# Altium schematic sheet STLINK.SchDoc: Title
size A3; Date: *******; ApprovedBy: *******; CheckedBy: None; Author: *******; CompanyName: *******; DrawnBy: Jacob Chisholm; Engineer: *******; Organization: *******; Address1: *******; Address2: *******; Address3: *******; Address4: *******; DocumentNumber: 1; Revision: *******; SheetNumber: 1; SheetTotal: 2; Address_Website: https://jchisholm204.github.io; E-Mail: JacobChisholm1010@gmail.com; CurrentTime: *******; CurrentDate: *******; Time: *******; DocumentFullPathAndName: *******; DocumentName: *******; ModifiedDate: *******; ImagePath: *******; ProjectName: *******; Application_BuildNumber: *******
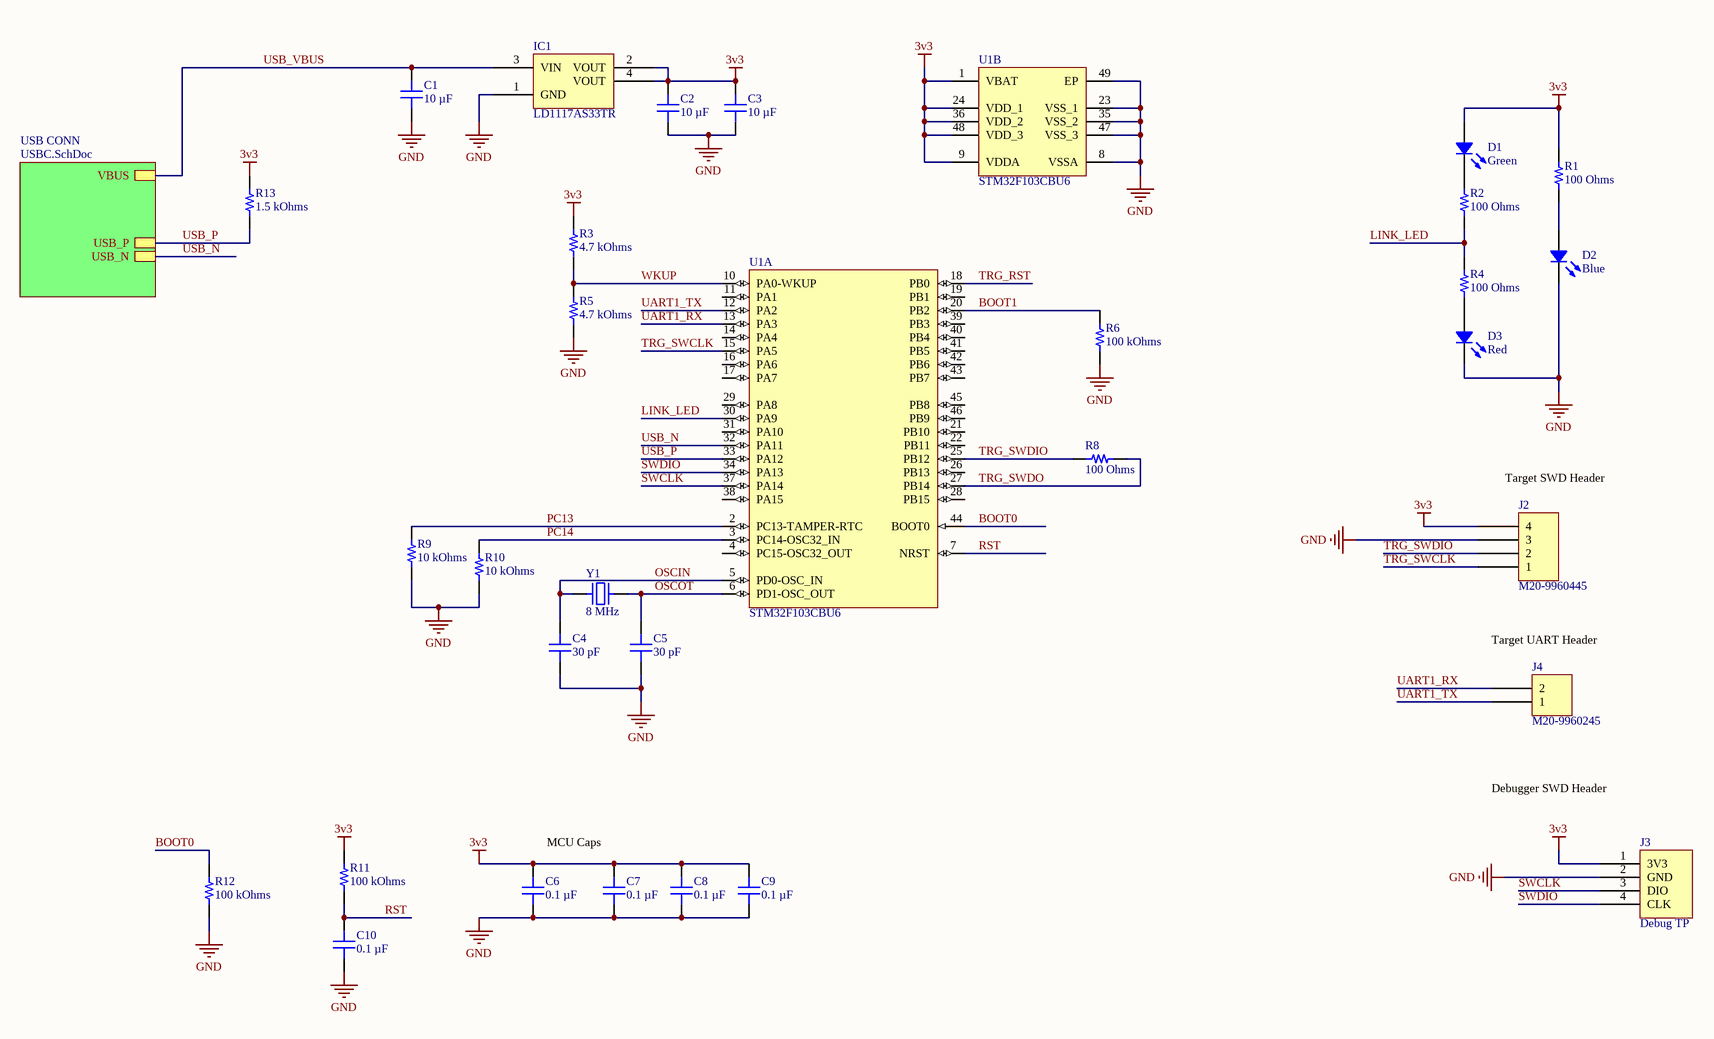
[diagram p0: STLINK.SchDoc]

## Parts
C1  10 µF  [CAP 0603_1608]
C2  10 µF  [CAP 0603_1608]
C3  10 µF  [CAP 0603_1608]
C4  30 pF  [CAP 0603_1608]
C5  30 pF  [CAP 0603_1608]
C6  0.1 µF  [CAP 0603_1608]
C7  0.1 µF  [CAP 0603_1608]
C8  0.1 µF  [CAP 0603_1608]
C9  0.1 µF  [CAP 0603_1608]
C10  0.1 µF  [CAP 0603_1608]
D1  Green  [LED 0603_1608 GREEN]
D2  Blue  [LED 0603_1608 BLUE]
D3  Red  [LED 0603_1608 RED]
IC1  LD1117AS33TR  [ST SOT-223]
J2  M20-9960445  [HARWIN M20-9960445]
J3  Debug TP  [CAPC2121X00N]
J4  M20-9960245  [HARWIN M20-9960245]
R1  100 Ohms  [RES 0603_1608]
R2  100 Ohms  [RES 0603_1608]
R3  4.7 kOhms  [RES 0603_1608]
R4  100 Ohms  [RES 0603_1608]
R5  4.7 kOhms  [RES 0603_1608]
R6  100 kOhms  [RES 0603_1608]
R8  100 Ohms  [RES 0603_1608]
R9  10 kOhms  [RES 0603_1608]
R10  10 kOhms  [RES 0603_1608]
R11  100 kOhms  [RES 0603_1608]
R12  100 kOhms  [RES 0603_1608]
R13  1.5 kOhms  [RES 0603_1608]
U1  STM32F103CBU6  [STM-UFQFPN48_N]  (parts A,B of 2)
Y1  8 MHz  [NDK NX3225GD]

## Sub-sheets
USB CONN = USBC.SchDoc: VBUS, USB_P, USB_N

## Nets
3v3: C2.2 C3.2 C6.2 C7.2 C8.2 C9.2 D1.1 IC1.2(VOUT) IC1.4(VOUT) J2.4 J3.1(3V3) R1.2 R3.2 R11.2 R13.2 U1.1(VBAT) U1.9(VDDA) U1.24(VDD_1) U1.36(VDD_2) U1.48(VDD_3)
GND: C1.1 C2.1 C3.1 C4.1 C5.1 C6.1 C7.1 C8.1 C9.1 C10.1 D2.2 D3.2 IC1.1(GND) J2.3 J3.2(GND) R5.1 R6.1 R9.1 R10.1 R12.1 U1.8(VSSA) U1.23(VSS_1) U1.35(VSS_2) U1.47(VSS_3) U1.49(EP)
BOOT0: R12.2 U1.44(BOOT0)
BOOT1: R6.2 U1.20(PB2)
LINK_LED: R2.1 R4.2 U1.30(PA9)
OSCIN: C4.2 U1.5(PD0-OSC_IN) Y1.1
OSCOT: C5.2 U1.6(PD1-OSC_OUT) Y1.2
PC13: R9.2 U1.2(PC13-TAMPER-RTC)
PC14: R10.2 U1.3(PC14-OSC32_IN)
RST: C10.2 R11.1 U1.7(NRST)
SWCLK: J3.3(DIO) U1.37(PA14)
SWDIO: J3.4(CLK) U1.34(PA13)
TRG_RST: U1.18(PB0)
TRG_SWCLK: J2.1 U1.15(PA5)
TRG_SWDIO: J2.2 R8.1 U1.25(PB12)
TRG_SWDO: R8.2 U1.27(PB14)
UART1_RX: J4.2 U1.13(PA3)
UART1_TX: J4.1 U1.12(PA2)
USB_N: U1.32(PA11) ; sheet USB CONN/USB_N
USB_P: R13.1 U1.33(PA12) ; sheet USB CONN/USB_P
USB_VBUS: C1.2 IC1.3(VIN) ; sheet USB CONN/VBUS
WKUP: R3.1 R5.2 U1.10(PA0-WKUP)
NetD1_2: D1.2 R2.2
NetD2_1: D2.1 R1.1
NetD3_1: D3.1 R4.1

Not connected (* = marked no-connect by the designer): U1 4(PC15-OSC32_OUT) 11(PA1) 14(PA4) 16(PA6) 17(PA7) 19(PB1) 21(PB10) 22(PB11) 26(PB13) 28(PB15) 29(PA8) 31(PA10) 38(PA15) 39(PB3) 40(PB4) 41(PB5) 42(PB6) 43(PB7) 45(PB8) 46(PB9)

## Notes on the sheet
- (near J2) Target SWD Header
- (near J4) Target UART Header
- Debugger SWD Header
- MCU Caps
- Title:
- Drawn By:
- Page Contents:
- Checked By:
- Size:
- Date:
- File:
- License:
- Email:
- A3
- Number:
- Time:
- Revision:
- Sheet
- Website:
- of

## Library data of the parts
C1-C3 = GMC10X5R106M10NT: CAP0603 X5R 10UF 20% 10V; manufacturer: Cal-Chip Electronics, Inc.; Part Number: GMC10X5R106M10NT; Value: 10 µF; Applications: General Purpose; Capacitance: 10 µF; componentlink1description: Datasheet; componentlink1url: https://88ce57.p3cdn1.secureserver.net/wp-content/uploads/2023/01/gmc_series-2.pdf; componentlink2description: DigiKey Link; componentlink2url: https://www.digikey.com/en/products/detail/cal-chip-electronics-inc/GMC10X5R106M10NT/18151101; Device Package: 0603 (1608 Metric); lastupdated: 2/9/2024 8:08:49 PM; Lifecycle Status: Active; Minimum Order: 1; Mounting Type: Surface Mount, MLCC; Operating Temperature: -55°C ~ 85°C; Package / Case: 0603 (1608 Metric); packaging: TapeAndReel; partid: 55951; price: 0.01; series: GMC; Size / Dimension: 0.063" L x 0.031" W (1.60mm x 0.80mm); Supplier 1: DigiKey; Supplier Part Number 1: 4713-GMC10X5R106M10NTCT-ND; Temperature Coefficient: X5R; Thickness (Max): 0.039" (1.00mm); Tolerance: ±20%; Voltage - Rated: 10V
C4 C5 = 0603N300J500CT: CAP CER 30PF 50V C0G/NP0 0603; manufacturer: Walsin Technology Corporation; Temperature Coefficient: C0G, NP0; Tolerance: ±5%; Part Number: 0603N300J500CT; Value: 30 pF; Applications: General Purpose; Capacitance: 30 pF; componentlink1description: Datasheet; componentlink1url: http://www.passivecomponent.com/wp-content/uploads/2018/10/MLCC.pdf; componentlink2description: DigiKey Link; componentlink2url: https://www.digikey.com/en/products/detail/walsin-technology-corporation/0603N300J500CT/9355012; Device Package: 0603 (1608 Metric); lastupdated: 2/9/2024 8:10:20 PM; Lifecycle Status: Active; Minimum Order: 1; Mounting Type: Surface Mount, MLCC; Operating Temperature: -55°C ~ 125°C; Package / Case: 0603 (1608 Metric); packaging: TapeAndReel; partid: 9974; Part Status: Active; price: 0.01; series: -; Size / Dimension: 0.063" L x 0.031" W (1.60mm x 0.80mm); Supplier 1: DigiKey; Supplier Part Number 1: 1292-1515-1-ND; Thickness (Max): 0.034" (0.87mm); Voltage - Rated: 50V
C6-C10 = GMC10X7R104K25NT: CAP0603 X7R .1UF 10% 25V; manufacturer: Cal-Chip Electronics, Inc.; Part Number: GMC10X7R104K25NT; Value: 0.1 µF; Applications: General Purpose; Capacitance: 0.1 µF; componentlink1description: Datasheet; componentlink1url: https://88ce57.p3cdn1.secureserver.net/wp-content/uploads/2023/01/gmc_series-2.pdf; componentlink2description: DigiKey Link; componentlink2url: https://www.digikey.com/en/products/detail/cal-chip-electronics-inc/GMC10X7R104K25NT/19910724; Device Package: 0603 (1608 Metric); lastupdated: 2/9/2024 8:08:39 PM; Lifecycle Status: Active; Minimum Order: 1; Mounting Type: Surface Mount, MLCC; Operating Temperature: -55°C ~ 125°C; Package / Case: 0603 (1608 Metric); packaging: TapeAndReel; partid: 56631; price: 0.01; series: GMC; Size / Dimension: 0.063" L x 0.031" W (1.60mm x 0.80mm); Supplier 1: DigiKey; Supplier Part Number 1: 4713-GMC10X7R104K25NTCT-ND; Temperature Coefficient: X7R; Thickness (Max): 0.035" (0.90mm); Tolerance: ±10%; Voltage - Rated: 25V
D1 = 19-213/GVC-AMNB/3T: LED GREEN CLEAR 2SMD; Manufacturer: Everlight Electronics Co Ltd; Configuration: Standard; Current - Test: 20mA; Lens Color: Colorless; Lens Size: 1.20mm x 0.80mm; Lens Style: Rectangle with Flat Top; Viewing Angle: 120°; Voltage - Forward (Vf) (Typ): 2.05V; Wavelength - Peak: 568nm; Part Number: 19-213/GVC-AMNB/3T; Color: Green; ComponentLink1Description: Datasheet; ComponentLink1URL: //media.digikey.com/pdf/Data%20Sheets/Everlight%20PDFs/19-213-GVC-AMNB-3T.pdf; ComponentLink2Description: DigiKey Link; ComponentLink2URL: https://www.digikey.com/en/products/detail/everlight-electronics-co-ltd/19-213-GVC-AMNB-3T/8535270; Device Package: 0603 (1608 Metric); Height (Max): 0.70mm; LastUpdated: 6/3/2024 7:58:53 PM; Lens Transparency: Clear; Lifecycle Status: Active; Minimum Order: 1; Mounting Type: Surface Mount; Package / Case: 0603 (1608 Metric); Packaging: TapeAndReel; PartId: 611; Part Status: Active; Price: 0.06; Series: -; Size / Dimension: 1.60mm L x 0.80mm W; Supplier 1: DigiKey; Supplier Part Number 1: 1080-1576-1-ND; Supplier Device Package: 2-SMD; Value: Green
D2 = 19-217/B7C-ZL2N1B3X/3T: LED BLUE CLEAR 2SMD; Manufacturer: Everlight Electronics Co Ltd; Configuration: Standard; Current - Test: 2mA; Lens Color: Colorless; Lens Size: 1.00mm x 0.80mm; Lens Style: Rectangle with Flat Top; Viewing Angle: 120°; Voltage - Forward (Vf) (Typ): 2.7V; Wavelength - Dominant: 470nm; Wavelength - Peak: 468nm; Part Number: 19-217/B7C-ZL2N1B3X/3T; Color: Blue; ComponentLink1Description: Datasheet; ComponentLink1URL: //media.digikey.com/pdf/Data%20Sheets/Everlight%20PDFs/19-217-B7C-ZL2N1B3X-3T.pdf; ComponentLink2Description: DigiKey Link; ComponentLink2URL: https://www.digikey.com/en/products/detail/everlight-electronics-co-ltd/19-217-B7C-ZL2N1B3X-3T/8535278; Device Package: 0603 (1608 Metric); Height (Max): 0.50mm; LastUpdated: 6/3/2024 7:57:52 PM; Lens Transparency: Clear; Lifecycle Status: Active; Minimum Order: 1; Mounting Type: Surface Mount; Package / Case: 0603 (1608 Metric); Packaging: TapeAndReel; PartId: 797; Part Status: Active; Price: 0.08; Series: -; Size / Dimension: 1.60mm L x 0.80mm W; Supplier 1: DigiKey; Supplier Part Number 1: 1080-1584-1-ND; Supplier Device Package: 2-SMD; Value: Blue
D3 = 19-213SDRC/S259/TR8: LED RED CLEAR 2SMD; Manufacturer: Everlight Electronics Co Ltd; Configuration: Standard; Current - Test: 10mA; Lens Color: Colorless; Lens Size: 1.20mm x 0.80mm; Lens Style: Rectangle with Flat Top; Viewing Angle: 120°; Voltage - Forward (Vf) (Typ): 2V; Wavelength - Peak: 650nm; Part Number: 19-213SDRC/S259/TR8; Color: Red; ComponentLink1Description: Datasheet; ComponentLink1URL: //media.digikey.com/pdf/Data%20Sheets/Everlight%20PDFs/19-213SDRC-S259-TR8.pdf; ComponentLink2Description: DigiKey Link; ComponentLink2URL: http://digikey.com/product-detail/en/everlight-electronics-co-ltd/19-213SDRC-S259-TR8/1080-1580-1-ND/8535303; Device Package: 0603 (1608 Metric); Height (Max): 0.70mm; LastUpdated: 6/3/2024 7:59:48 PM; Lens Transparency: Clear; Lifecycle Status: Active; Minimum Order: 1; Mounting Type: Surface Mount; Package / Case: 0603 (1608 Metric); Packaging: TapeAndReel; PartId: 372; Part Status: Active; Price: 0.06; Series: -; Size / Dimension: 1.60mm L x 0.80mm W; Supplier 1: DigiKey; Supplier Part Number 1: 1080-1580-1-ND; Supplier Device Package: 2-SMD; Value: Red
IC1 = LD1117AS33TR: IC REG LINEAR 3.3V 1A SOT223; Manufacturer: STMicroelectronics; Current - Quiescent (Iq): 10 mA; Number of Regulators: 1; Output Configuration: Positive; Output Type: Fixed; Protection Features: Over Current, Over Temperature; PSRR: 75dB (120Hz); Voltage Dropout (Max): 1.3V @ 1A; Voltage - Input (Max): 15V; Part Number: LD1117AS33TR; ComponentLink1Description: Datasheet; ComponentLink1URL: http://www.st.com/content/ccc/resource/technical/document/datasheet/a5/c3/3f/c9/2b/15/40/49/CD00002116.pdf/files/CD00002116.pdf/jcr:content/translations/en.CD00002116.pdf; ComponentLink2Description: DigiKey Link; ComponentLink2URL: https://www.digikey.com/en/products/detail/stmicroelectronics/LD1117AS33TR/585752; Current - Output: 1A; LastUpdated: 6/3/2024 8:14:21 PM; Lifecycle Status: Active; Minimum Order: 1; Mounting Type: Surface Mount; Operating Temperature: 0°C ~ 125°C; Package / Case: TO-261-4, TO-261AA; Packaging: TapeAndReel; Part Status: Active; Price: 0.32; Series: -; Supplier 1: DigiKey; Supplier Part Number 1: 497-1228-1-ND; Supplier Device Package: SOT-223; Voltage - Output (Min/Fixed): 3.3V
J2 = M20-9960445: CONN HEADER R/A 4POS 2.54MM; Manufacturer: Harwin Inc.; Connector Type: Header, Cuttable; Contact Length - Mating: 0.240" (6.10mm); Contact Length - Post: 0.118" (3.00mm); Current Rating (Amps): 3A per Contact; Material Flammability Rating: UL94 V-0; Number of Positions: 4; Number of Positions Loaded: All; Pitch - Mating: 0.100" (2.54mm); Row Spacing - Mating: -40°C ~ 105°C; Shrouding: Unshrouded; Style: Board to Board or Cable; Part Number: M20-9960445; ComponentLink1Description: Datasheet; ComponentLink1URL: https://cdn.harwin.com/pdfs/Harwin_PC_Connectors_M20.pdf; ComponentLink2Description: DigiKey Link; ComponentLink2URL: https://www.digikey.com/en/products/detail/harwin-inc/M20-9960445/3921052; Contact Finish - Mating: Gold; Contact Material: Brass; Contact Shape: Square; Contact Type: Male Pin; Fastening Type: Push-Pull; Insulation Color: Black; Insulation Height: 0.100" (2.54mm); Insulation Material: Polyamide (PA6T), Nylon 6T; LastUpdated: 9/21/2022 7:23:20 PM; Lifecycle Status: Active; Minimum Order: 1; Mounting Type: Through Hole, Right Angle; Number of Rows: 1; Operating Temperature: -40°C ~ 105°C; Packaging: Bulk; PartId: 167; Part Status: Active; Price: 0.11; Series: M20; Supplier 1: DigiKey; Supplier Part Number 1: 952-3286-ND; Termination: Solder
J3 = CMP-00016-1: ST-Link Test Point
J4 = M20-9960245: CONN HEADER R/A 2POS 2.54MM; Manufacturer: Harwin Inc.; Connector Type: Header, Cuttable; Contact Length - Mating: 0.240" (6.10mm); Contact Length - Post: 0.118" (3.00mm); Current Rating (Amps): 3A per Contact; Material Flammability Rating: UL94 V-0; Number of Positions: 2; Number of Positions Loaded: All; Pitch - Mating: 0.100" (2.54mm); Row Spacing - Mating: -40°C ~ 105°C; Shrouding: Unshrouded; Style: Board to Board or Cable; Part Number: M20-9960245; ComponentLink1Description: Datasheet; ComponentLink1URL: https://cdn.harwin.com/pdfs/Harwin_PC_Connectors_M20.pdf; ComponentLink2Description: DigiKey Link; ComponentLink2URL: https://www.digikey.com/en/products/detail/harwin-inc/M20-9960245/3728208; Contact Finish - Mating: Gold; Contact Material: Brass; Contact Shape: Square; Contact Type: Male Pin; Fastening Type: Push-Pull; Insulation Color: Black; Insulation Height: 0.100" (2.54mm); Insulation Material: Polyamide (PA6T), Nylon 6T; LastUpdated: 9/21/2022 7:22:55 PM; Lifecycle Status: Active; Minimum Order: 1; Mounting Type: Through Hole, Right Angle; Number of Rows: 1; Operating Temperature: -40°C ~ 105°C; Packaging: Bulk; PartId: 165; Part Status: Active; Price: 0.07; Series: M20; Supplier 1: DigiKey; Supplier Part Number 1: 952-2244-ND; Termination: Solder
R1 R2 R4 R8 = RCA0603100RJNEA: RCA0603 100R 5% 200 ET1 E3; Manufacturer: Vishay Dale; Power (Watts): 0.1W, 1/10W; Temperature Coefficient: ±200ppm/°C; Part Number: RCA0603100RJNEA; Value: 100 Ohms; ComponentLink1Description: Datasheet; ComponentLink1URL: https://www.vishay.com/docs/20037/rcae3.pdf; ComponentLink2Description: DigiKey Link; ComponentLink2URL: https://www.digikey.com/en/products/detail/vishay-dale/RCA0603100RJNEA/19522959; Composition: Thick Film; Device Package: 0603 (1608 Metric); Features: Anti-Sulfur, Automotive AEC-Q200; Height - Seated (Max): 0.020" (0.50mm); LastUpdated: 2/9/2024 8:40:41 PM; Lifecycle Status: Active; Minimum Order: 1; Number of Terminations: 2; Operating Temperature: -55°C ~ 155°C; Package / Case: 0603 (1608 Metric); Packaging: TapeAndReel; PartId: 78145; Part Status: Active; Price: 0.01; Ratings: AEC-Q200; Resistance: 100 Ohms; Series: RCA; Size / Dimension: 0.061" L x 0.033" W (1.55mm x 0.85mm); Supplier 1: DigiKey; Supplier Part Number 1: 541-RCA0603100RJNEACT-ND; Supplier Device Package: 0603; Tolerance: ±5%
R3 R5 = ERA-3VRW4701V: RES 4.7K OHM 0.05% 1/8W 0603; Manufacturer: Panasonic Electronic Components; Power (Watts): 0.125W, 1/8W; Temperature Coefficient: ±10ppm/°C; Part Number: ERA-3VRW4701V; Value: 4.7 kOhms; ComponentLink1Description: Datasheet; ComponentLink1URL: https://api.pim.na.industrial.panasonic.com/file_stream/main/fileversion/9152; ComponentLink2Description: DigiKey Link; ComponentLink2URL: https://www.digikey.com/en/products/detail/panasonic-electronic-components/ERA-3VRW4701V/12086954; Composition: Thin Film; Device Package: 0603 (1608 Metric); Features: Anti-Sulfur, Automotive AEC-Q200; Height - Seated (Max): 0.022" (0.55mm); LastUpdated: 2/9/2024 8:41:01 PM; Lifecycle Status: Active; Minimum Order: 1; Number of Terminations: 2; Operating Temperature: -55°C ~ 155°C; Package / Case: 0603 (1608 Metric); Packaging: TapeAndReel; PartId: 71885; Part Status: Active; Price: 0.19; Ratings: AEC-Q200; Resistance: 4.7 kOhms; Series: ERA-3V; Size / Dimension: 0.063" L x 0.031" W (1.60mm x 0.80mm); Supplier 1: DigiKey; Supplier Part Number 1: 10-ERA-3VRW4701VCT-ND; Supplier Device Package: 0603; Tolerance: ±0.05%
R6 R11 R12 = MCT0603MG1003BP500: MCT 0603-05 0.1% AT P5 100K; Manufacturer: Vishay Beyschlag/Draloric/BC Components; Power (Watts): 0.21W; Temperature Coefficient: ±5ppm/°C; Part Number: MCT0603MG1003BP500; Value: 100 kOhms; ComponentLink1Description: Datasheet; ComponentLink1URL: https://www.vishay.com/docs/28952/mcs0402at-mcs0603at-mcu0805at-mca1206at.pdf; ComponentLink2Description: DigiKey Link; ComponentLink2URL: https://www.digikey.com/en/products/detail/vishay-beyschlag-draloric-bc-components/MCT0603MG1003BP500/19251865; Composition: Thin Film; Device Package: 0603 (1608 Metric); Features: Anti-Sulfur, Automotive AEC-Q200, Moisture Resistant; Height - Seated (Max): 0.022" (0.55mm); LastUpdated: 2/9/2024 8:40:40 PM; Lifecycle Status: Active; Minimum Order: 1; Number of Terminations: 2; Operating Temperature: -55°C ~ 175°C; Package / Case: 0603 (1608 Metric); Packaging: TapeAndReel; PartId: 78329; Part Status: Active; Price: 0.72; Ratings: AEC-Q200; Resistance: 100 kOhms; Series: MCT AT - Precision; Size / Dimension: 0.061" L x 0.033" W (1.55mm x 0.85mm); Supplier 1: DigiKey; Supplier Part Number 1: 749-MCT0603MG1003BP500CT-ND; Supplier Device Package: 0603; Tolerance: ±0.1%
R9 R10 = MCT0603MG1002BP500: MCT 0603-05 0.1% AT P5 10K; Manufacturer: Vishay Beyschlag/Draloric/BC Components; Power (Watts): 0.21W; Temperature Coefficient: ±5ppm/°C; Part Number: MCT0603MG1002BP500; Value: 10 kOhms; ComponentLink1Description: Datasheet; ComponentLink1URL: https://www.vishay.com/docs/28952/mcs0402at-mcs0603at-mcu0805at-mca1206at.pdf; ComponentLink2Description: DigiKey Link; ComponentLink2URL: https://www.digikey.com/en/products/detail/vishay-beyschlag-draloric-bc-components/MCT0603MG1002BP500/19251868; Composition: Thin Film; Device Package: 0603 (1608 Metric); Features: Anti-Sulfur, Automotive AEC-Q200, Moisture Resistant; Height - Seated (Max): 0.022" (0.55mm); LastUpdated: 2/9/2024 8:40:40 PM; Lifecycle Status: Active; Minimum Order: 1; Number of Terminations: 2; Operating Temperature: -55°C ~ 175°C; Package / Case: 0603 (1608 Metric); Packaging: TapeAndReel; PartId: 78314; Part Status: Active; Price: 0.72; Ratings: AEC-Q200; Resistance: 10 kOhms; Series: MCT AT - Precision; Size / Dimension: 0.061" L x 0.033" W (1.55mm x 0.85mm); Supplier 1: DigiKey; Supplier Part Number 1: 749-MCT0603MG1002BP500CT-ND; Supplier Device Package: 0603; Tolerance: ±0.1%
R13 = PTN0603Y1501BST1: PTN0603 10PPM 1.5K 0.1% S T1 E1; Manufacturer: Vishay Dale Thin Film; Power (Watts): 0.15W; Temperature Coefficient: ±10ppm/°C; Part Number: PTN0603Y1501BST1; Value: 1.5 kOhms; ComponentLink1Description: Datasheet; ComponentLink1URL: https://www.vishay.com/docs/60026/ptn.pdf; ComponentLink2Description: DigiKey Link; ComponentLink2URL: https://www.digikey.com/en/products/detail/vishay-dale-thin-film/PTN0603Y1501BST1/12820673; Composition: Thin Film; Device Package: 0603 (1608 Metric); Features: Anti-Sulfur, Moisture Resistant, Non-Inductive; Height - Seated (Max): 0.020" (0.51mm); LastUpdated: 2/9/2024 8:41:32 PM; Lifecycle Status: Active; Minimum Order: 1; Number of Terminations: 2; Operating Temperature: -55°C ~ 155°C; Package / Case: 0603 (1608 Metric); Packaging: TapeAndReel; PartId: 63062; Part Status: Active; Price: 0.27; Resistance: 1.5 kOhms; Series: PTN; Size / Dimension: 0.064" L x 0.032" W (1.63mm x 0.81mm); Supplier 1: DigiKey; Supplier Part Number 1: 764-PTN0603Y1501BST1CT-ND; Supplier Device Package: 0603; Tolerance: ±0.1%
U1 = CMP-0237-00051-3: ARM Cortex-M3 32-bit MCU, 128 KB Flash, 20 KB Internal RAM, 37 I/Os, 48-pin UFQFPN, -40 to 85 degC, Tray; I/Os (High Current): 37; Supply Voltage(Vcc) min (V): 2; FLASH Size (Prog) (kB): 128; Operating Frequency(F) (Processor speed) (MHz): 72; A/D Converter: 2x12-bit (10 Channel); Internal RAM Size (kB): 20; DatasheetVersion: Rev. 16; ComponentLink2Description: Datasheet; ComponentLink3Description: Package Specification; ComponentLink1URL: http://www.st.com/web/en/home.html; PackageVersion: Rev. 1, 04/2013; ComponentLink2URL: http://www.st.com/st-web-ui/static/active/en/resource/technical/document/datasheet/CD00161566.pdf; PackageDescription: 48-Pin Ultra Thin Fine Pitch Quad Flat No-Lead, 7 x 7 x 0.6 mm Body, 0.5 mm Pitch, Exposed Pad; Mounting Technology: Surface Mount; Packing: Tray; Core: ARM Cortex-M3; ComponentLink3URL: http://www.st.com/st-web-ui/static/active/en/resource/technical/document/data_brief/DM00071938.pdf; PackageReference: UFQFPN48; ComponentLink1Description: Manufacturer URL; PartNumber: STM32F103CBU6
Y1 = NX3225GD-8MHZ-EXS00A-CG04874: CRYSTAL 8.0000MHZ 8PF SMD; Manufacturer: NDK America, Inc.; ESR (Equivalent Series Resistance): 500 Ohms; Frequency Stability: ±50ppm; Frequency Tolerance: ±20ppm; Operating Mode: Fundamental; Part Number: NX3225GD-8MHZ-EXS00A-CG04874; ComponentLink2Description: DigiKey Link; ComponentLink2URL: https://www.digikey.com/en/products/detail/ndk-america-inc/NX3225GD-8MHZ-EXS00A-CG04874/9172047; Frequency: 8 MHz; Height - Seated (Max): 0.039" (1.00mm); LastUpdated: 6/3/2024 8:17:11 PM; Lifecycle Status: Active; Load Capacitance: 8pF; Minimum Order: 1; Mounting Type: Surface Mount; Operating Temperature: -40°C ~ 150°C; Package / Case: 2-SMD, No Lead; Packaging: TapeAndReel; PartId: 746; Part Status: Active; Price: 0.37; Ratings: AEC-Q200; Series: NX3225GD; Size / Dimension: 0.126" L x 0.098" W (3.20mm x 2.50mm); Supplier 1: DigiKey; Supplier Part Number 1: 644-1391-1-ND; Type: MHz Crystal; Value: 8 MHz